# EAGLE design dynacomp (EAGLE 7.6.0)
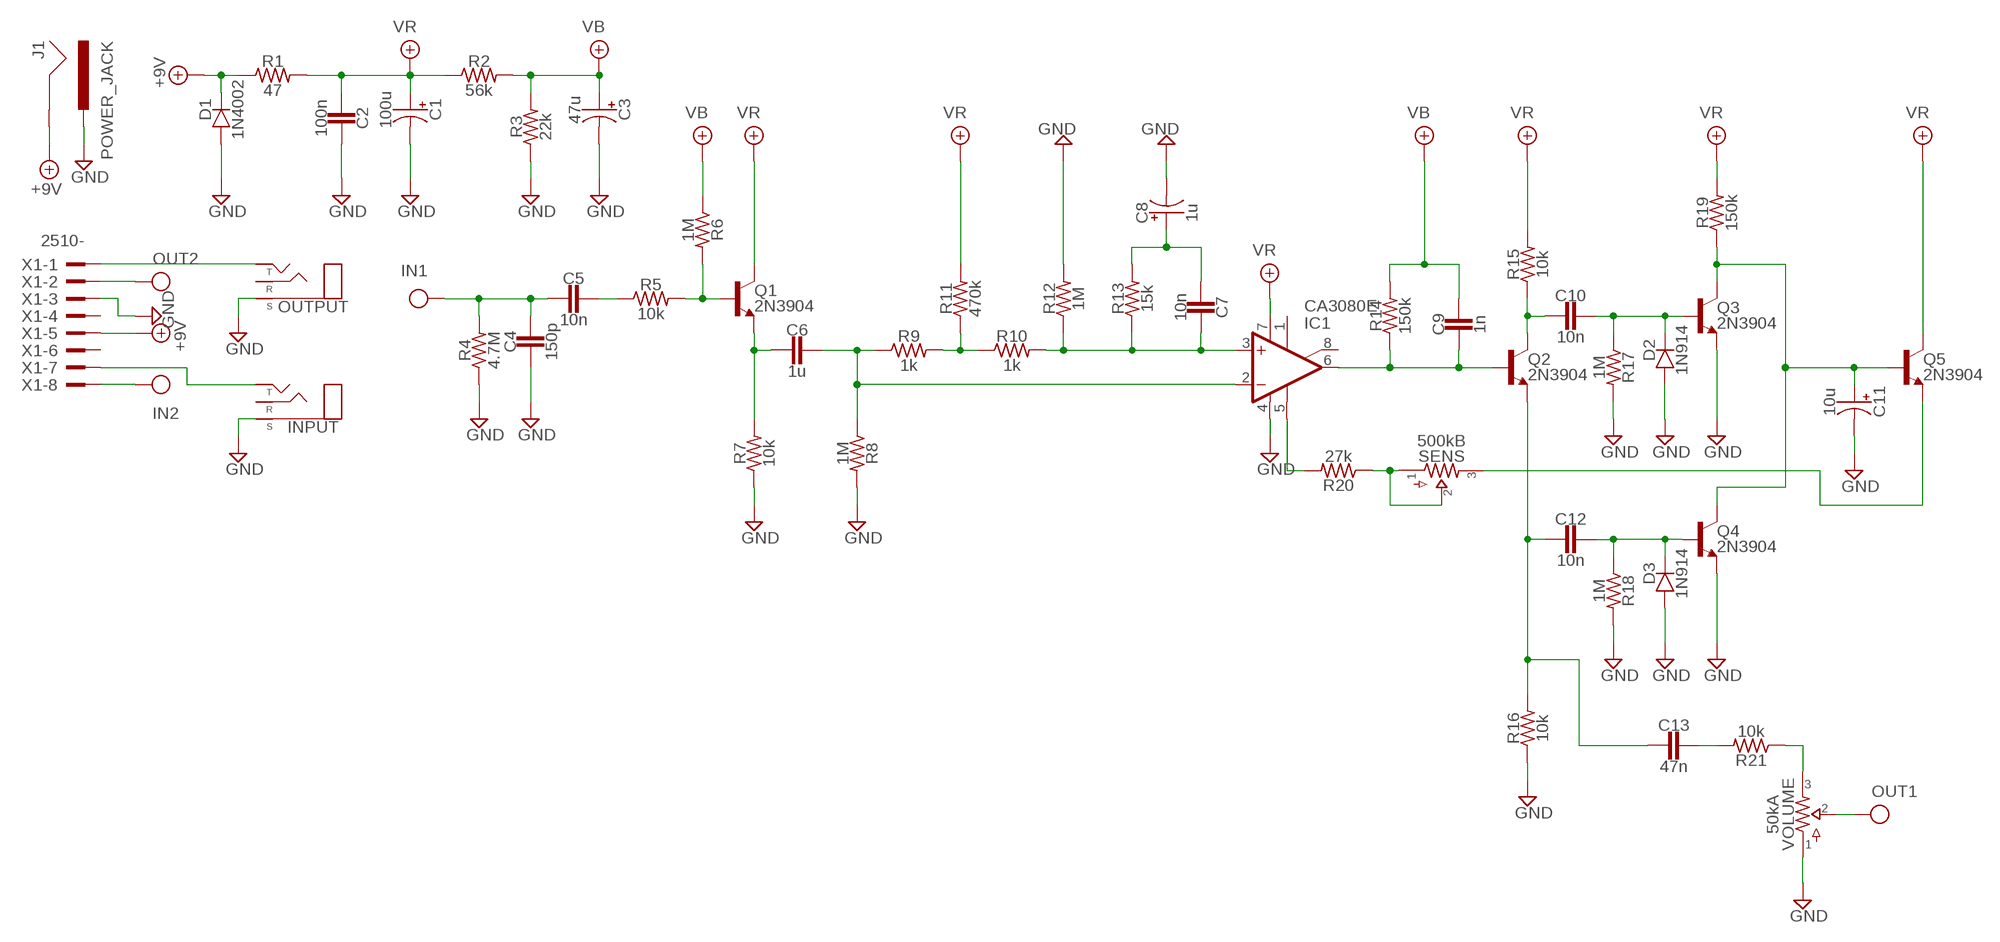
[diagram p0: schematic, sheet 1]

## Parts
C1  100u  0400  [040_020]
C2  100n  CER/FILM2  [050X030_025_2]
C3  47u  0400  [040_020]
C4  150p  CER/FILM2  [050X030_025_2]
C5  10n  CER/FILMBOX.1  [BOX_SMALL]
C6  1u  CER/FILMBOX.3  [BOX_BIG]
C7  10n  CER/FILMBOX.1  [BOX_SMALL]
C8  1u  0400  [040_020]
C9  1n  CER/FILMBOX.1  [BOX_SMALL]
C10  10n  CER/FILMBOX.1  [BOX_SMALL]
C11  10u  0400  [040_020]
C12  10n  CER/FILMBOX.1  [BOX_SMALL]
C13  47n  CER/FILMBOX.1  [BOX_SMALL]
D1  1N4002  DO41.2  [DO41-2]
D2  1N914  DO35.2  [DO35-2]
D3  1N914  DO35.2  [DO35-2]
IC1  CA3080E  3080TH  [DIL08]
INPUT  STEREONMJ  [NMJ6HCD2]
J1  POWER_JACK  [POWER_JACK_PTH]
OUTPUT  STEREONMJ  [NMJ6HCD2]
Q1  2N3904  [TO92-]
Q2  2N3904  [TO92-]
Q3  2N3904  [TO92-]
Q4  2N3904  [TO92-]
Q5  2N3904  [TO92-]
R1  47  R_.3B  [R0207/3]
R2  56k  R_.3B  [R0207/3]
R3  22k  R_.3B  [R0207/3]
R4  4.7M  R_.3B  [R0207/3]
R5  10k  R_.3B  [R0207/3]
R6  1M  R_.3B  [R0207/3]
R7  10k  R_.3B  [R0207/3]
R8  1M  R_.3B  [R0207/3]
R9  1k  R_.3B  [R0207/3]
R10  1k  R_.3B  [R0207/3]
R11  470k  R_.3B  [R0207/3]
R12  1M  R_.3B  [R0207/3]
R13  15k  R_.3B  [R0207/3]
R14  150k  R_.3B  [R0207/3]
R15  10k  R_.3B  [R0207/3]
R16  10k  R_.3B  [R0207/3]
R17  1M  R_.3B  [R0207/3]
R18  1M  R_.3B  [R0207/3]
R19  150k  R_.3B  [R0207/3]
R20  27k  R_.3B  [R0207/3]
R21  10k  R_.3B  [R0207/3]
SENS  500kB  POTS16MM  [16MM]
VOLUME  50kA  POTS16MM  [16MM]
X1  2510-  [PAK100/2500-10]

## Nets
+9V: D1.C J1.GND R1.1 X1.5
C8: C6.1 IC1.2(-IN) R8.1 R9.1
C10: C7.2 C8.+ R13.2
C40: C13.1 R21.2
GND: C1.- C2.1 C3.- C4.2 C8.- C11.- D1.A D2.A D3.A IC1.4(V-) INPUT.S J1.PWR OUTPUT.S Q3.3(E) Q4.3(E) R3.1 R4.1 R7.1 R8.2 R12.2 R16.1 R17.2 R18.2 VOLUME.1 X1.3
IN: C4.1 C5.2 R4.2 X1.8
N$1: C12.2 C13.2 Q2.3(E) R16.2
N$2: INPUT.T X1.7
N$3: C5.1 R5.1
N$4: OUTPUT.T X1.1
N$5: Q1.2(B) R5.2 R6.2
N$6: IC1.5(OPT) R20.2
N$8: C11.+ Q3.1(C) Q4.1(C) Q5.2(B) R19.1
N$9: C6.2 Q1.3(E) R7.2
N$10: C7.1 IC1.3(+IN) R10.2 R12.1 R13.1
N$11: R9.2 R10.1 R11.1
N$12: R20.1 SENS.1 SENS.2
N$13: Q5.3(E) SENS.3
N$14: C10.2 Q2.1(C) R15.1
N$15: C9.2 IC1.6(OUT) Q2.2(B) R14.1
N$16: R21.1 VOLUME.3
N$17: C10.1 D2.C Q3.2(B) R17.1
N$19: C12.1 D3.C Q4.2(B) R18.1
OUT: VOLUME.2 X1.2
VB: C3.+ C9.1 R2.2 R3.2 R6.1 R14.2
VR: C1.+ C2.2 IC1.7(V+) Q1.1(C) Q5.1(C) R1.2 R2.1 R11.2 R15.2 R19.2
Unconnected: IC1.1(ON1) IC1.8(ON2) INPUT.R OUTPUT.R X1.4 X1.6

## Library data of the parts
C1 C3 C8 C11 = pedals-capacitors-elec:040
C2 C4-C7 C9 C10 C12 C13 = pedals-capacitors-film:CER/FILM: 47 - 120pF Xicon Ceramic Disc 2.5mm lead spacing
D1 = pedals-diodes:DO41: DO-41 Package Diodes: 1N4001 - 1N40019 Zener Diodes: 1N4728 - 1N4764
D2 D3 = pedals-diodes:DO35: DO-35 Package Diodes: 1N914
IC1 = pedals-integrated circuits:3080: OP AMP
INPUT OUTPUT = pedals-jacks:STEREO
J1 = pedals-jacks:POWER_JACK: Power Jack Connector This is the standard 5.5mm barrel jack for power. The PTH is the most common, proven, reliable, footprint. The Slot footprint only works if the mill layer is transmitted to the PCB fab house so be warned. Here are the connectors we sell at SparkFun: DC Barrel Power Jack/Connector <https://www.sparkfun.com/products/119> (PRT-00119) DC Barrel Power Jack/Connector (SMD) <https://www.sparkfun.com/products/12748> (PRT-12748) DC Barrel Jack Adapter - Breadboard Compatible <https://www.sparkfun.com/products/10811> (PRT-10811) It is used on this SparkFun product (and many, many others): SparkFun RedBoard - Programmed with Arduino <https://www.sparkfun.com/products/12757> (DEV-12757) Also, if you need a mating power supply or connector, please check these out: Wall Adapter Power Supply - 9VDC 650mA <https://www.sparkfun.com/products/298> (TOL-00298) DC Barrel Jack Adapter - Male <https://www.sparkfun.com/products/10287> (PRT-10287); PROD_ID: CONN-08197
Q1-Q5 = pedals-transistors:2N3904: NPN Transistor
R1-R21 = pedals-resistors:R_
SENS VOLUME = pedals-potentiometers:POTS
X1 = pedals-headers:2510-: 3M (TM) Pak 100 4-Wall Header Source: 3M; MF: 3M; MPN: 2510-6002UB; OC_FARNELL: 9838244; OC_NEWARK: 46F4725

## Board
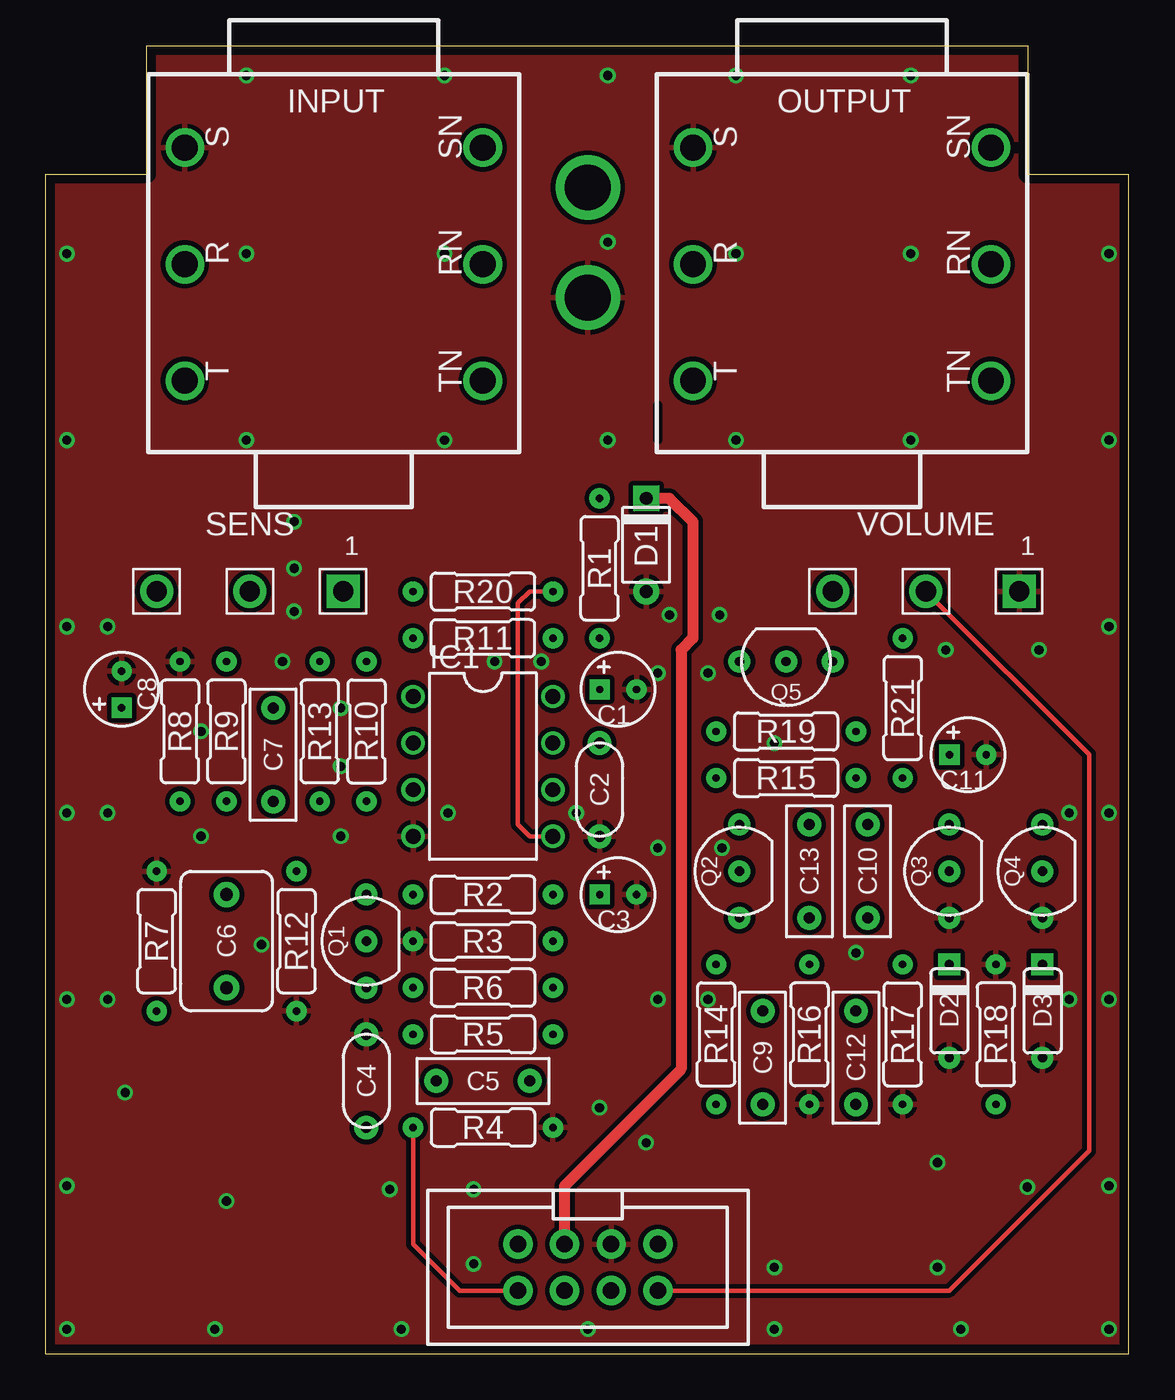
[diagram p1: board, top side]
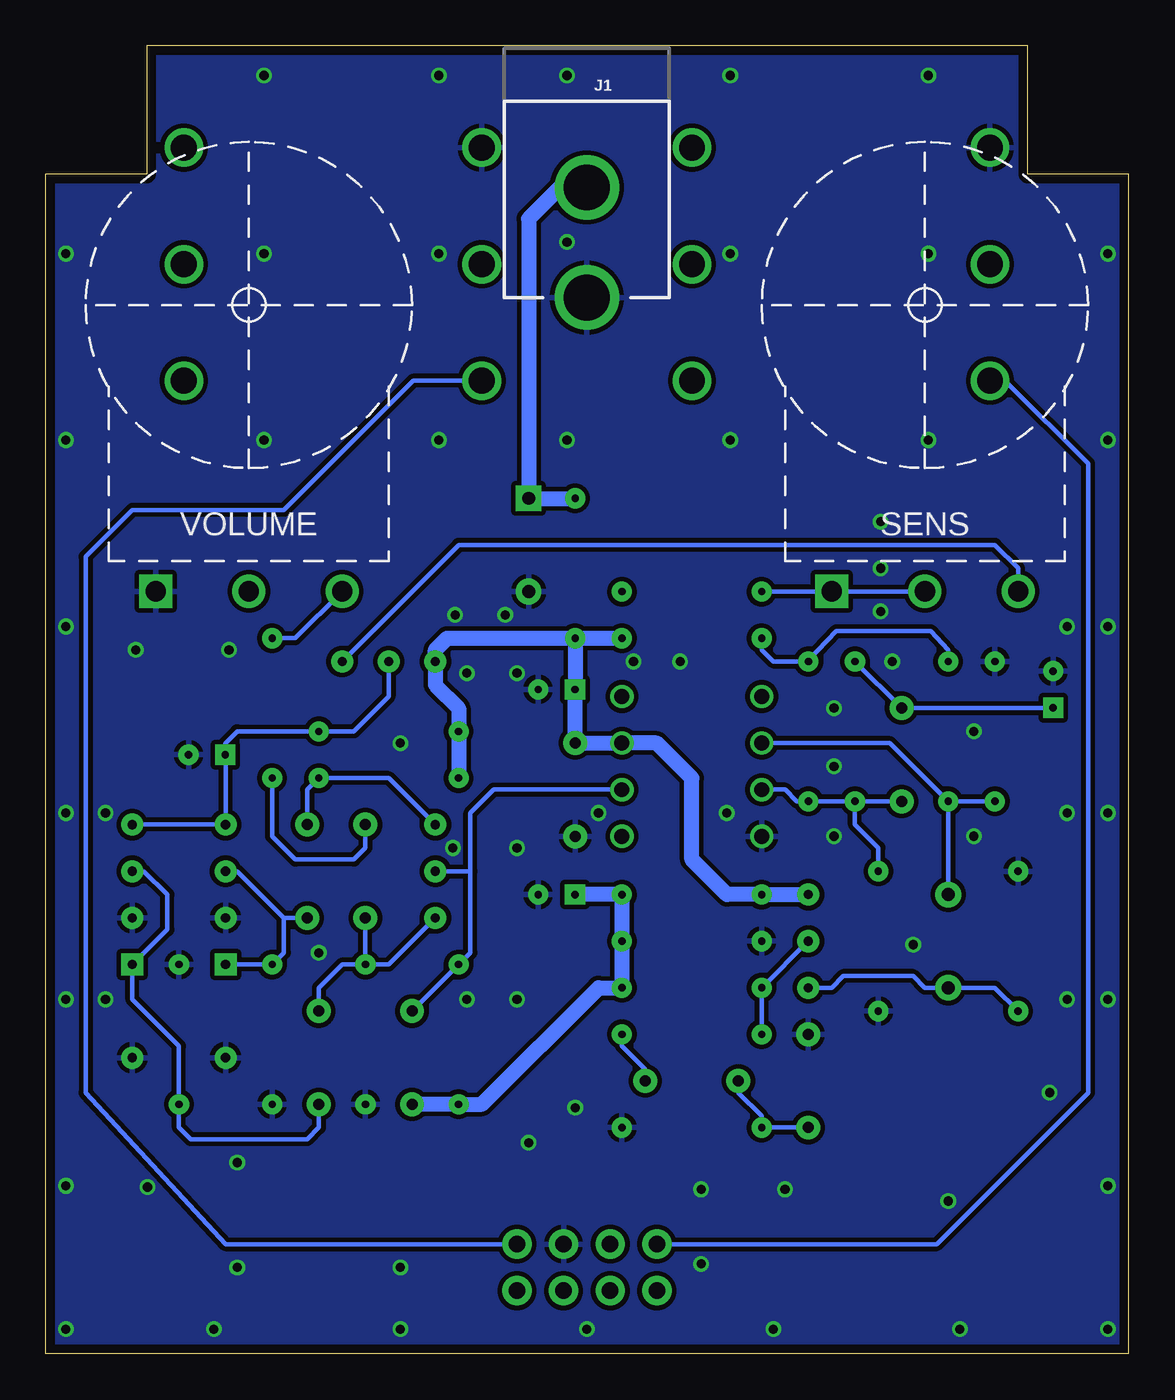
[diagram p2: board, bottom side, seen from below]

Size 59 x 71.27 mm. Coordinates in mm from the lower left corner, seen from the top.
Copper layers (1*16): Top 0.035mm / dielectric 1.6mm / Bottom 0.035mm
Design rules "Elecrow_2-layer_PCB_eagle_rule": minimum track width 6mil, minimum drill 12mil, track to track 6mil, track to pad 6mil, pad to pad 6mil, via to via 8mil, smd to smd 0mil, copper to edge 20mil, drill to drill 10mil, minimum pad ring 6mil, minimum via ring 6mil, stop-mask expansion 0mil, vias tented up to drill 100mil, thermal gap 10mil
tRestrict: 1 lines

### Footprints (pad centres in the part's own frame; a part is rotated, then mirrored left to right if it is on the bottom)
040_020 = drill 0.4 pad 1.1 square: + -1.001,0 | drill 0.4 pad 1.1: - 1.001,0
050X030_025_2 = drill 0.6 pad 1.3: 1 -2.54,0; 2 2.54,0
BOX_SMALL = drill 0.6 pad 1.3: 1 -2.54,0; 2 2.54,0
BOX_BIG = drill 0.7 pad 1.4: 1 -2.54,0; 2 2.54,0
DO41-2 = drill 0.7 pad 1.4: A 2.54,0 | drill 0.7 pad 1.4 square: C -2.54,0
DO35-2 = drill 0.5 pad 1.2: A 2.54,0 | drill 0.5 pad 1.2 square: C -2.54,0
DIL08 = drill 0.813 pad 1.27: 1 -3.81,-3.81; 2 -1.27,-3.81; 3 1.27,-3.81; 4 3.81,-3.81; 5 3.81,3.81; 6 1.27,3.81; 7 -1.27,3.81; 8 -3.81,3.81
NMJ6HCD2 = drill 1.4: R 0,8.115; RN 0,-8.115; S 6.35,8.115; SN 6.35,-8.115; T -6.35,8.115; TN -6.35,-8.115
POWER_JACK_PTH = drill 2.5: GND 0,7.7; PWR 0,13.7
TO92- = drill 0.5 pad 1.2: 1 2.54,0; 2 0,0; 3 -2.54,0
R0207/3 = drill 0.4 pad 1.1: 1 -3.81,0; 2 3.81,0
16MM = drill 1.1 pad 1.8 square: 1 5.08,-1 | drill 1.1 pad 1.8: 2 0,-1; 3 -5.08,-1
PAK100/2500-10 = drill 0.9 pad 1.6: 1 -3.81,-1.27; 2 -3.81,1.27; 3 -1.27,-1.27; 4 -1.27,1.27; 5 1.27,-1.27; 6 1.27,1.27; 7 3.81,-1.27; 8 3.81,1.27

### Placement (x,y rotation side)
C1  31.18,36.19 0 top
C2  30.16,30.73 90 top
C3  31.18,25.02 0 top
C4  17.46,14.86 90 top
C5  23.81,14.86 180 top
C6  9.84,22.48 270 top
C7  12.38,32.64 90 top
C8  4.13,36.19 90 top
C9  39.05,16.13 90 top
C10  44.77,26.29 90 top
C11  50.23,32.64 0 top
C12  44.13,16.13 90 top
C13  41.59,26.29 270 top
D1  32.7,44.07 270 top
D2  49.21,18.67 270 top
D3  54.29,18.67 270 top
IC1  23.81,32 270 top
INPUT  15.68,59.37 90 top
J1  29.53,71.25 180 bottom
OUTPUT  43.37,59.37 90 top
Q1  17.46,22.48 90 top
Q2  37.78,26.29 90 top
Q3  49.21,26.29 90 top
Q4  54.29,26.29 90 top
Q5  40.32,37.72 180 top
R1  30.16,42.8 270 top
R2  23.81,25.02 0 top
R3  23.81,22.48 0 top
R4  23.81,12.32 180 top
R5  23.81,17.4 180 top
R6  23.81,19.94 180 top
R7  6.03,22.48 270 top
R8  7.3,33.91 90 top
R9  9.84,33.91 90 top
R10  17.46,33.91 270 top
R11  23.81,38.99 0 top
R12  13.65,22.48 270 top
R13  14.92,33.91 90 top
R14  36.51,17.4 270 top
R15  40.32,31.37 180 top
R16  41.59,17.4 90 top
R17  46.67,17.4 270 top
R18  51.75,17.4 90 top
R19  40.32,33.91 180 top
R20  23.81,41.53 0 top
R21  46.67,35.18 270 top
SENS  11.11,42.55 0 top
U$1  [125B_PCB]  0,1.27 0 top
VOLUME  47.94,42.55 0 top
X1  29.53,4.7 180 top

### Tracks (layer width: path | path; a pad name or v marks a point on that pad's centre or on a via)
+9V
  Top 0.61: X1.5 28.26,9.14 34.61,15.49 34.61,38.35 35.24,38.99 35.24,45.34 33.97,46.61 D1.C
  Bottom 0.813: J1.GND 31,63.55 32.7,61.85 D1.C R1.1
C8
  Bottom 0.254: R8.1 R9.1 | R9.1 C6.1 | R9.1 13.02,33.27 IC1.2
C10
  Bottom 0.254: C8.+ 4.14,35.18 C7.2 R13.2
C40
  Bottom 0.254: C13.1 41.59,27.56 42.23,26.92 45.4,26.92 46.67,28.19 R21.2
GND  (via drill 0.5 pad 0.85)
  other vias: 57.91,59.94 57.91,49.78 10.92,69.66 21.72,69.66 30.61,69.66 1.14,49.78 10.92,59.94 10.92,49.78 21.72,59.94 21.72,49.78 30.61,60.58 37.59,69.66 47.12,69.66 37.59,59.94 37.59,49.78 47.12,59.94 47.12,49.78 57.91,39.62 57.91,29.46 57.91,19.3 57.91,9.14 57.91,1.33 49.85,1.33 39.69,1.33 29.53,1.33 19.37,1.33 9.21,1.33 1.14,1.33 1.14,59.94 1.14,39.62 1.14,29.46 1.14,19.3 1.14,9.14 30.61,49.78 54.1,38.35 55.75,29.46 55.75,19.3 36.07,19.3 33.34,19.3 36.83,27.56 33.34,27.56 23.3,4.89 23.3,8.95 39.69,4.7 48.58,4.7 53.47,9.08 18.73,8.95 9.84,8.32 4.32,14.22 3.37,19.3 3.37,29.46 3.37,39.62 36.07,37.08 33.34,37.08 36.7,40.26 33.97,40.26 49.02,38.35 16.07,28.19 16.07,32 16.07,35.18 12.89,37.72 13.53,40.45 13.53,42.8 13.53,45.34 28.89,29.46 21.91,29.46 8.45,28.19 8.45,33.91 32.7,11.49 30.16,13.4 26.99,37.72 24.45,37.72 48.58,10.41 44.13,21.84 39.69,33.27 11.75,22.29
  pour Bottom (isolate 0.254): 0.32,70.74 58.74,70.74 58.74,-1.02 0.32,-1.02
  pour Top (isolate 0.254): 59.37,0.25 59.37,71.37 -0.32,71.37 -0.32,-0.38 59.37,-0.38
IN
  Top 0.254: X1.8 22.54,3.43 20,5.97 R4.2
  Bottom 0.254: C4.1 R4.2 20,12.95 21.27,14.22 C5.2
N$1
  Bottom 0.254: R16.2 40.32,21.21 Q2.3 | R16.2 C13.2 | R16.2 42.86,21.21 44.13,19.94 C12.2
N$2
  Bottom 0.254: X1.7 10.48,5.97 2.22,14.22 2.22,48.51 6.67,52.96 7.51,52.96 INPUT.T
N$3
  Bottom 0.254: C5.1 26.35,15.49 27.62,16.76 R5.1
N$4
  Bottom 0.254: OUTPUT.T 38.99,53.02 46.04,45.97 54.29,45.97 56.83,43.43 56.83,14.22 49.21,5.97 X1.1
N$5
  Bottom 0.254: R5.2 R6.2 Q1.2
N$6
  Top 0.254: IC1.5 26.35,28.19 25.72,28.83 25.72,40.89 26.35,41.53 R20.2
N$8
  Bottom 0.254: Q5.2 40.32,35.81 42.23,33.91 R19.1 48.58,33.91 49.23,33.26 C11.+ 49.21,32.62 Q3.1 Q4.1
N$9
  Bottom 0.254: R7.2 7.3,19.94 C6.2 11.11,19.94 11.75,20.57 15.56,20.57 16.19,19.94 Q1.3
N$10
  Bottom 0.254: C7.1 R13.1 | R13.1 R10.2 18.1,30.1 18.73,30.73 IC1.3 | R12.1 13.65,27.56 14.92,28.83 R13.1
N$11
  Bottom 0.254: R11.1 20,38.35 19.37,37.72 R10.1 17.46,37.78 15.94,39.37 10.79,39.37 9.84,38.35 R9.2
N$12
  Bottom 0.254: SENS.2 SENS.1 19.99,41.55 R20.1
N$13
  Bottom 0.254: SENS.3 6.03,42.8 7.3,44.07 36.51,44.07 Q5.3
N$14
  Bottom 0.254: Q2.1 40.32,31.37 R15.1 44.77,30.73 C10.2
N$15
  Bottom 0.254: IC1.6 34.61,30.73 35.88,29.46 35.88,26.29 | C9.2 R14.1 35.88,21.84 35.88,26.29 | Q2.2 35.88,26.29
N$16
  Bottom 0.254: R21.1 45.42,38.99 VOLUME.3
N$17
  Bottom 0.254: C10.1 46.04,23.75 | 46.04,23.75 48.58,26.29 Q3.2 | D2.C R17.1 46.04,21.84 46.04,23.75
N$19
  Bottom 0.254: Q4.2 53.66,26.29 52.39,25.02 52.39,23.11 D3.C 54.29,19.3 51.75,16.76 R18.1 51.75,12.32 51.12,11.68 44.77,11.68 44.13,12.32 C12.1
OUT
  Top 0.254: X1.2 49.21,3.43 56.83,11.05 56.83,32.66 VOLUME.2
VB
  Bottom 0.813: C3.+ R2.2 R3.2 R6.1 28.89,19.94 35.24,13.59 R14.2 C9.1
VR
  Bottom 0.813: R1.2 30.16,36.21 C1.+ 30.18,33.29 | 30.18,33.29 C2.2 | R1.2 R11.2 | 30.18,33.29 27.64,33.29 IC1.7 25.72,33.27 23.81,31.37 23.81,26.92 21.91,25.02 R2.1 Q1.1 | R1.2 37.15,38.99 37.78,38.35 Q5.1 37.78,36.45 36.51,35.18 R19.2 R15.2